# Altium schematic sheet UBYKE mainboard schematic.SchDoc
size A
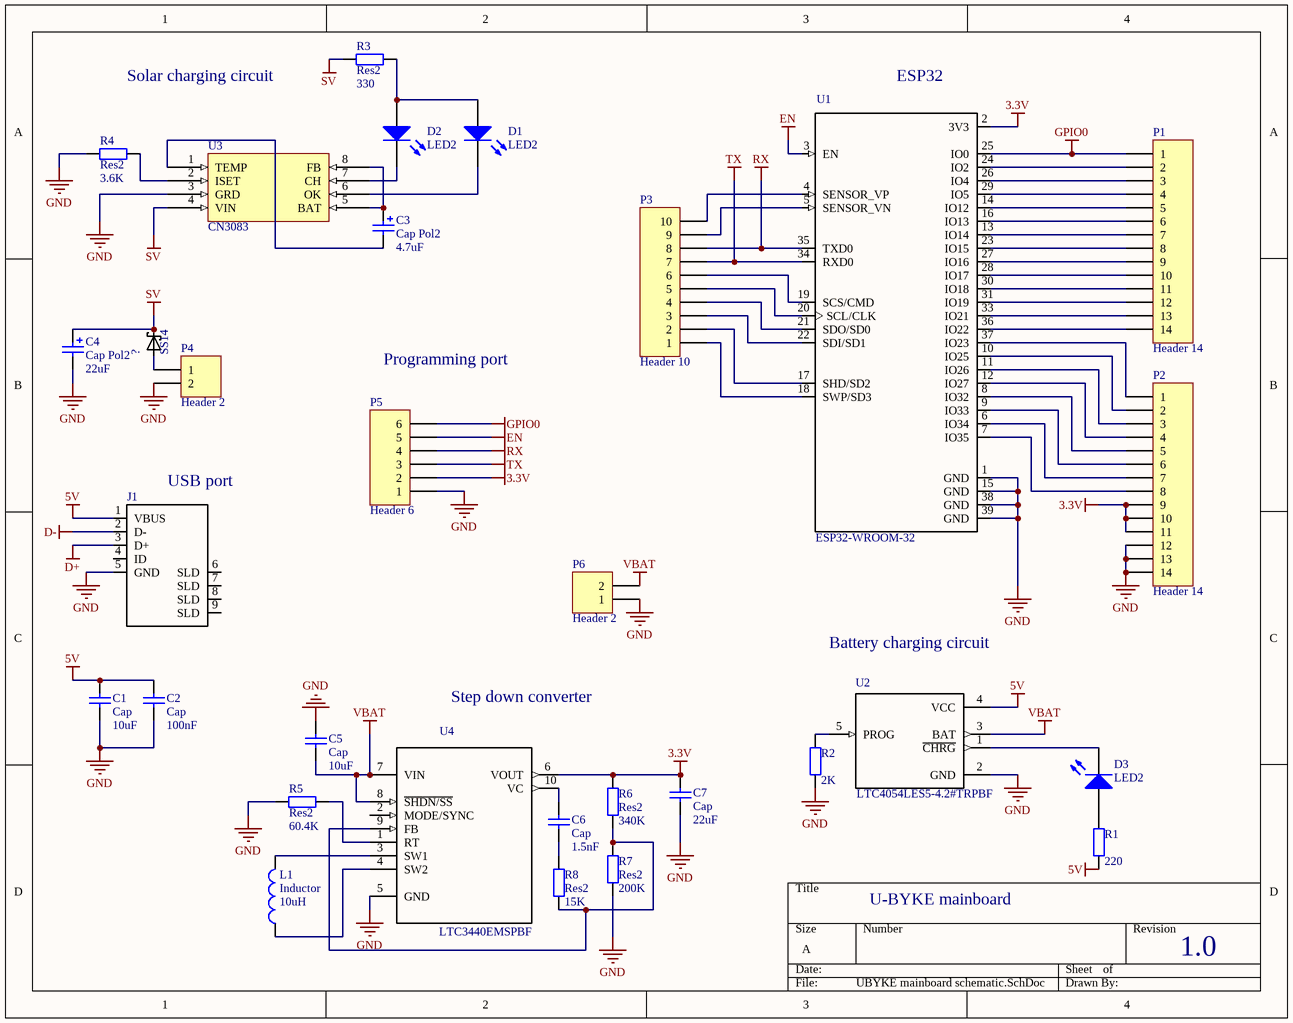
[diagram p0: UBYKE mainboard schematic.SchDoc]

## Parts
?  SS14  [*DO-214AC_SS14(Primary)]
C1  Cap  value 10uF  [RAD-0.3]
C2  Cap  value 100nF  [RAD-0.3]
C3  Cap Pol2  value 4.7uF  [POLAR0.8]
C4  Cap Pol2  value 22uF  [POLAR0.8]
C5  Cap  value 10uF  [RAD-0.3]
C6  Cap  value 1.5nF  [RAD-0.3]
C7  Cap  value 22uF  [RAD-0.3]
D1  LED2  [3.2X1.6X1.1]
D2  LED2  [3.2X1.6X1.1]
D3  LED2  [3.2X1.6X1.1]
J1  1734035-1  [*TE_1734035-1]  (value not drawn)
L1  Inductor  value 10uH  [0402-A]
P1  Header 14  [HDR1X14]
P2  Header 14  [HDR1X14]
P3  Header 10  [HDR1X10]
P4  Header 2  [HDR1X2]
P5  Header 6  [HDR1X6]
P6  Header 2  [HDR1X2]
R1  value 220  [AXIAL-0.4]
R2  value 2K  [AXIAL-0.4]
R3  Res2  value 330  [AXIAL-0.4]
R4  Res2  value 3.6K  [AXIAL-0.4]
R5  Res2  value 60.4K  [AXIAL-0.4]
R6  Res2  value 340K  [AXIAL-0.4]
R7  Res2  value 200K  [AXIAL-0.4]
R8  Res2  value 15K  [AXIAL-0.4]
U1  ESP32-WROOM-32  [*MODULE_ESP32-WROOM-32D]
U2  LTC4054LES5-4.2#TRPBF  [*SOT95P280X100-5N]
U3  CN3083
U4  LTC3440EMSPBF  [*SOP50P490X110-10N]

## Nets
3.3V: C7.2 P2.9 P2.10 P2.11 P5.2 R6.2 U1.2(3V3) U4.6(VOUT)
5V: C1.2 C2.2 J1.1(VBUS) R1.1 U2.4(VCC)
D+: J1.3(D+)
D-: J1.2(D-)
EN: P5.5 U1.3(EN)
GND: C1.1 C2.1 C4.2 C5.2 C7.1 J1.5(GND) P2.12 P2.13 P2.14 P4.2 P5.1 P6.1 R2.1 R4.1 R5.1 R7.1 U1.1(GND) U1.15(GND) U1.38(GND) U1.39(GND) U2.2(GND) U3.3(GRD) U4.5(GND)
GPIO0: P1.1 P5.6 U1.25(IO0)
RX: P3.8 P5.4 U1.35(TXD0)
SV: ?.C C4.1 R3.1 U3.4(VIN)
TX: P3.7 P5.3 U1.34(RXD0)
VBAT: C5.1 P6.2 U2.3(BAT) U4.7(VIN) U4.8(~{SHDN/SS})
Net?_A: ?.A P4.1
NetC3_1: C3.1 U3.5(BAT) U3.8(FB)
NetC3_2: C3.2 U3.1(TEMP)
NetC6_1: C6.1 R8.2
NetC6_2: C6.2 U4.10(VC)
NetD1_1: D1.1(A) D2.1(A) R3.2
NetD1_2: D1.2(K) U3.6(OK)
NetD2_2: D2.2(K) U3.7(CH)
NetD3_1: D3.1(A) R1.2
NetD3_2: D3.2(K) U2.1(~{CHRG})
NetL1_1: L1.1 U4.4(SW2)
NetL1_2: L1.2 U4.3(SW1)
NetP1_2: P1.2 U1.24(IO2)
NetP1_3: P1.3 U1.26(IO4)
NetP1_4: P1.4 U1.29(IO5)
NetP1_5: P1.5 U1.14(IO12)
NetP1_6: P1.6 U1.16(IO13)
NetP1_7: P1.7 U1.13(IO14)
NetP1_8: P1.8 U1.23(IO15)
NetP1_9: P1.9 U1.27(IO16)
NetP1_10: P1.10 U1.28(IO17)
NetP1_11: P1.11 U1.30(IO18)
NetP1_12: P1.12 U1.31(IO19)
NetP1_13: P1.13 U1.33(IO21)
NetP1_14: P1.14 U1.36(IO22)
NetP2_1: P2.1 U1.37(IO23)
NetP2_2: P2.2 U1.10(IO25)
NetP2_3: P2.3 U1.11(IO26)
NetP2_4: P2.4 U1.12(IO27)
NetP2_5: P2.5 U1.8(IO32)
NetP2_6: P2.6 U1.9(IO33)
NetP2_7: P2.7 U1.6(IO34)
NetP2_8: P2.8 U1.7(IO35)
NetP3_1: P3.1 U1.18(SWP/SD3)
NetP3_2: P3.2 U1.17(SHD/SD2)
NetP3_3: P3.3 U1.22(SDI/SD1)
NetP3_4: P3.4 U1.21(SDO/SD0)
NetP3_5: P3.5 U1.20(SCL/CLK)
NetP3_6: P3.6 U1.19(SCS/CMD)
NetP3_9: P3.9 U1.5(SENSOR_VN)
NetP3_10: P3.10 U1.4(SENSOR_VP)
NetR2_2: R2.2 U2.5(PROG)
NetR4_2: R4.2 U3.2(ISET)
NetR5_2: R5.2 U4.1(RT)
NetR6_1: R6.1 R7.2 R8.1 U4.9(FB)

Not connected (* = marked no-connect by the designer): J1 4(ID) 6(SLD) 7(SLD) 8(SLD) 9(SLD); U4 2(MODE/SYNC)

## Notes on the sheet
- Solar charging circuit
- (near U1) ESP32
- Programming port
- (near J1) USB port
- Step down converter
- Battery charging circuit
- U-BYKE mainboard
- 1.0

## Library data of the parts
? = SS14: SS14 Series 500 mV 1 A 40 V Max Reverse Voltage Schottky Rectifier - DO-214AC; MF: ON Semiconductor; Availability: Unavailable; Price: None; MP: SS14; Package: DO-214AC-214 ON Semiconductor; SnapEDA_Link: https://www.snapeda.com/parts/SS14/ON%20Semiconductor/view-part/?ref=snap; Value: *
C1 C2 C5-C7 = Cap: Capacitor; Published: 8-Jun-2000; LatestRevisionDate: 17-Jul-2002; LatestRevisionNote: Re-released for DXP Platform.; PackageReference: RAD-0.3; Publisher: Altium Limited; PackageDescription: Radial Cap, Thru-Hole; 2 Leads; 0.3 in Pin Spacing
C3 C4 = Cap Pol2: Polarized Capacitor (Axial); Published: 8-Jun-2000; LatestRevisionDate: 17-Jul-2002; LatestRevisionNote: Re-released for DXP Platform.; PackageReference: POLAR0.8; Publisher: Altium Limited; PackageDescription: Polarized Capacitor; 2 Leads
D1-D3 = LED2: Typical RED, GREEN, YELLOW, AMBER GaAs LED; Published: 8-Jun-2000; LatestRevisionDate: 17-Jul-2002; LatestRevisionNote: Re-released for DXP Platform.; PackageVersion: Feb-2002; PackageReference: 3.2X1.6X1.1; Publisher: Altium Limited; PackageDescription: SM LED; 2 Flat Leads
J1 = 1734035-1: Mini USB,R/A,SMT,B Type,pbFree; Number_of_Positions: 5; Product_Type: Connector; Centerline_Pitch: .8 mm[.031 in]; MF: TE Connectivity; Availability: Unavailable; TE_purchase_URL: https://www.te.com/usa-en/product-1734035-1.html?te_bu=Cor&te_type=disp&te_campaign=seda_glo_cor-seda-global-disp-prtnr-fy19-seda-model-bom-cta_sma-317_1&elqCampaignId=32493; Price: None; MP: 1734035-1; Package: None; SnapEDA_Link: https://www.snapeda.com/parts/1734035-1/TE%20Connectivity%20AMP%20Connectors/view-part/?ref=snap; EU_RoHS_Compliance: Compliant; Value: *
L1 = Inductor: Code_IEC: 1005; Published: 8-Jun-2000; LatestRevisionDate: 29-May-2009; LatestRevisionNote: IPC-7351 Footprint Added.; PackageReference: 0402-A; Publisher: Altium Limited; PackageDescription: Chip Inductor; Code_JEITA: 0402
P1 P2 = Header 14: Header, 14-Pin; LatestRevisionDate: 17-Jul-2002; LatestRevisionNote: Re-released for DXP Platform.; Publisher: Altium Limited
P3 = Header 10: Header, 10-Pin; LatestRevisionDate: 17-Jul-2002; LatestRevisionNote: Re-released for DXP Platform.; Publisher: Altium Limited
P4 P6 = Header 2: Header, 2-Pin; LatestRevisionDate: 17-Jul-2002; LatestRevisionNote: Re-released for DXP Platform.; Publisher: Altium Limited
P5 = Header 6: Header, 6-Pin; LatestRevisionDate: 17-Jul-2002; LatestRevisionNote: Re-released for DXP Platform.; Publisher: Altium Limited
R1-R8 = Res2: Resistor; Published: 8-Jun-2000; LatestRevisionDate: 17-Jul-2002; LatestRevisionNote: Re-released for DXP Platform.; PackageReference: AXIAL-0.4; Publisher: Altium Limited; PackageDescription: Axial Device, Thru-Hole; 2 Leads; 0.4 in Pin Spacing
U1 = ESP32-WROOM-32D: / IC: SoC; GPIO, I2C, I2S, IR, SD, SDIO, SPI, UART; 2.7Ã·3.6VDC; 20dBm /; MF: Espressif Systems; Package: Module Espressif Systems; MP: ESP32-WROOM-32D; Price: None; SnapEDA_Link: https://www.snapeda.com/parts/ESP32-WROOM-32D/Espressif%20Systems/view-part/?ref=snap; Availability: Unavailable; Value: *
U2 = LTC4054LES5-4.2#TRPBF: LTC4054L-4.2 - 150mA Standalone Linear Li-Ion Battery Charger in ThinSOT; MF: Linear Technology/Analog; Price: None; Package: SOT-23-5 Linear Technology; SnapEDA_Link: https://www.snapeda.com/parts/LTC4054LES5-4.2%23TRPBF/Analog%20Devices/view-part/?ref=snap; Availability: Unavailable; MP: LTC4054LES5-4.2#TRPBF; Value: *
U4 = LTC3440EMSPBF: Con Volt DC-DC Single Output Non-In Volt In Volt Step Up/Step Down 10-Pin MSOP; MP: LTC3440EMS#PBF; MF: Linear Technology/Analog; Availability: Unavailable; SnapEDA_Link: https://www.snapeda.com/parts/LTC3440EMS%23PBF/Analog%20Devices/view-part/?ref=snap; Price: None; Package: MSOP-10 Linear Technology; Value: *